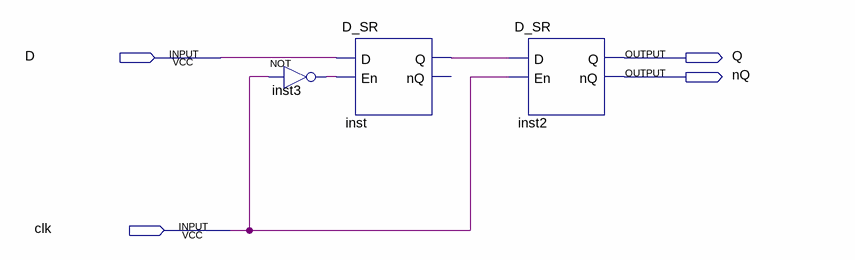
[diagram p0: schematic sheet]
// Quartus schematic D_ff.bdf as structural Verilog: 3 symbols, 4 pins
module D_ff (
  input  D,
  input  clk,
  output Q,
  output nQ
);

  wire inst3_out, inst_q;

  not inst3 (inst3_out, clk);
  D_SR inst (.D(D), .En(inst3_out), .Q(inst_q));  // open: nQ
  D_SR inst2 (.D(inst_q), .En(clk), .Q(Q), .nQ(nQ));
endmodule
